# Altium schematic sheet MainBoard_V100_PSU.SchDoc
size A4; SheetNumber: 3; SheetTotal: 22; Title_: PSU
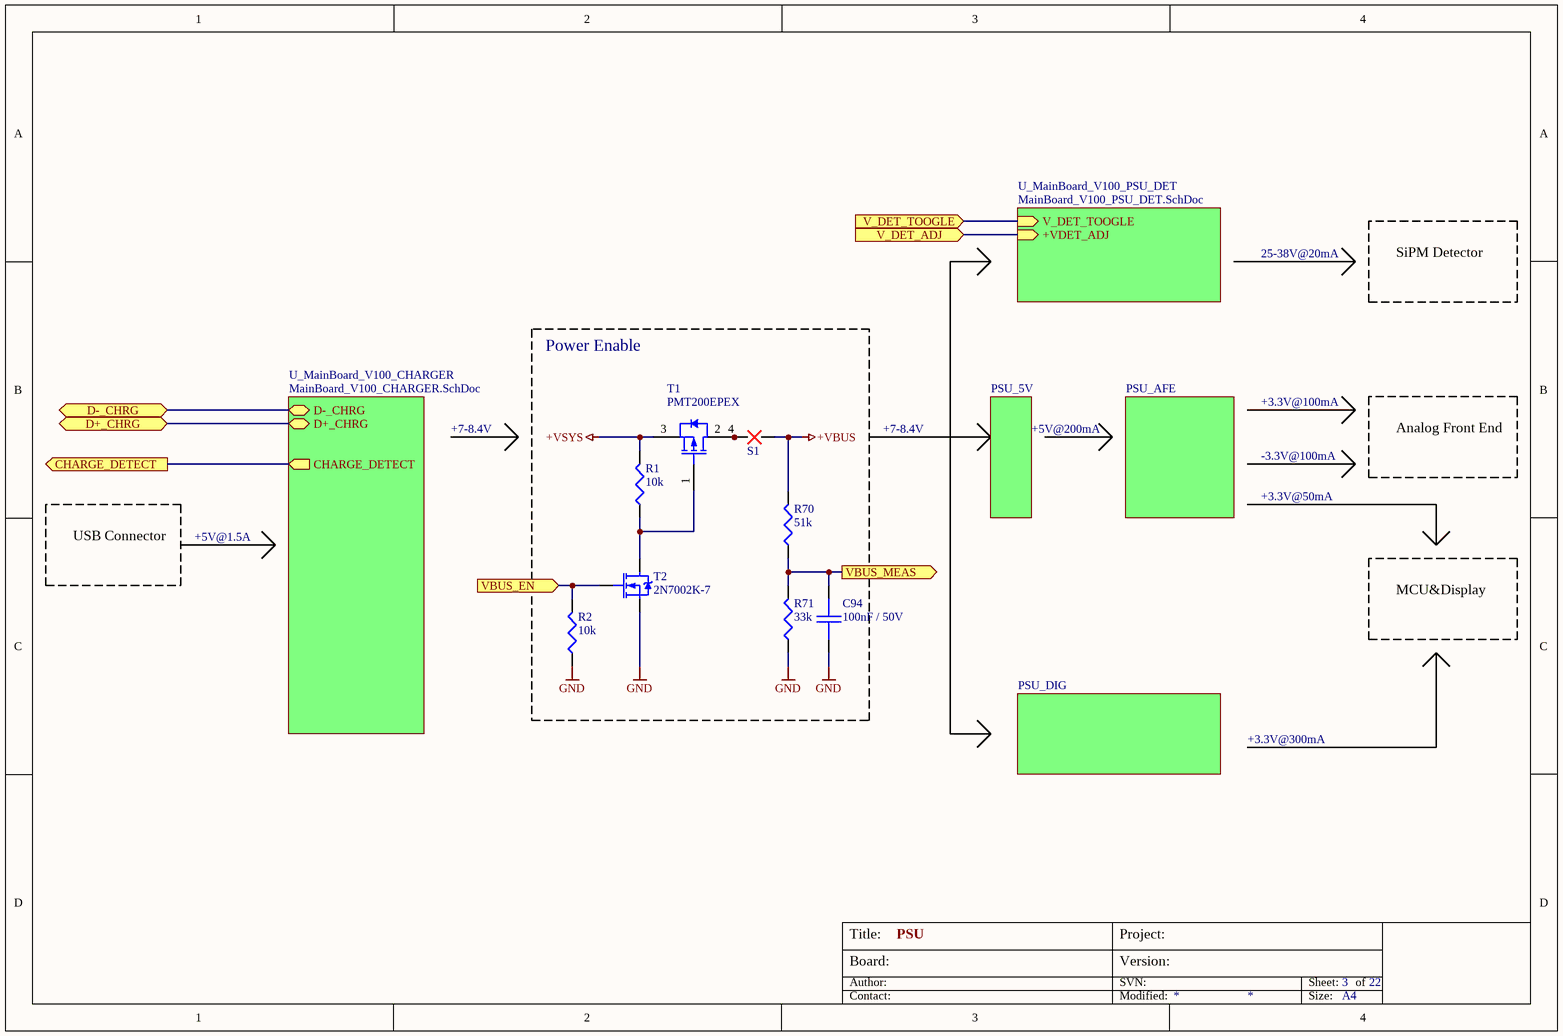
[diagram p0: MainBoard_V100_PSU.SchDoc]

## Parts
C94  100nF / 50V  [0805_C]
R1  10k  [0805]
R2  10k  [0805]
R70  51k  [0805]
R71  33k  [0805]
S1  SPLITER  [SPLITER2_30mil_9mil]  (value not drawn)  (no BOM)
T1  PMT200EPEX  [SOT-223]
T2  2N7002K-7  [SOT-23]

## Blocks framed on the sheet
Power Enable: C94 R1 R2 R70 R71 S1 T1 T2

## Sub-sheets
PSU_5V = MainBoard_V100_PSU_5V.SchDoc: no entries
PSU_AFE = MainBoard_V100_PSU_AFE.SchDoc: no entries
PSU_DIG = MainBoard_V100_PSU_DIG.SchDoc: no entries
U_MainBoard_V100_CHARGER = MainBoard_V100_CHARGER.SchDoc: D-_CHRG (bidir), D+_CHRG (bidir), CHARGE_DETECT (out)
U_MainBoard_V100_PSU_DET = MainBoard_V100_PSU_DET.SchDoc: V_DET_TOOGLE (in), +VDET_ADJ (in)

## Ports
CHARGE_DETECT (out), D+_CHRG (bidir), D-_CHRG (bidir), V_DET_ADJ (in), V_DET_TOOGLE (in), VBUS_EN (in), VBUS_MEAS (out)

## Nets
+VBUS: R70.2 S1.2
+VSYS: R1.2 T1.3(SOURCE)
GND: C94.2 R2.1 R71.1 T2.2(S)
CHARGE_DETECT: port CHARGE_DETECT, sheet U_MainBoard_V100_CHARGER/CHARGE_DETECT
D+_CHRG: port D+_CHRG, sheet U_MainBoard_V100_CHARGER/D+_CHRG
D-_CHRG: port D-_CHRG, sheet U_MainBoard_V100_CHARGER/D-_CHRG
V_DET_ADJ: port V_DET_ADJ, sheet U_MainBoard_V100_PSU_DET/+VDET_ADJ
V_DET_TOOGLE: port V_DET_TOOGLE, sheet U_MainBoard_V100_PSU_DET/V_DET_TOOGLE
VBUS_EN: R2.2 T2.1(G) ; port VBUS_EN
VBUS_MEAS: C94.1 R70.1 R71.2 ; port VBUS_MEAS
NetR1_1: R1.1 T1.1(GATE) T2.3(D)
NetS1_1: S1.1 T1.2(DRAIN) T1.4(DRAIN)

## Notes on the sheet
- 25-38V@20mA
- SiPM Detector
- +7-8.4V
- +5V@200mA
- +3.3V@100mA
- Analog Front End
- -3.3V@100mA
- +3.3V@50mA
- USB Connector
- +5V@1.5A
- MCU&Display
- +3.3V@300mA
- Board:
- Author:
- Title:
- Project:
- SVN:
- Version:
- Sheet:
- of
- Contact:
- Modified:
- Size:
- A4

## Library data of the parts
C94 = 149: 100nF 50V X7R; Part Number: SMD0805-100nF-50V; Azonosító: 149; Category: Passives; Subcategory: PASS_Capacitor; Supplier 1: HESTORE; Supplier 1 order number: 100.011.22
R1 R2 = 59: 10k 0805 0.125W 1%; Part Number: SMD0805-10k 1%; Azonosító: 59; Category: Passives; Subcategory: PASS_Resistor; Supplier 1: HESTORE; Supplier 1 order number: 100.403.38
R70 = 64: 51k 0805 0.125W 5%; Part Number: SMD0805-51k 5%; Azonosító: 64; Category: Passives; Subcategory: PASS_Resistor; Supplier 1: HESTORE; Supplier 1 order number: 100.201.72
R71 = 62: 33k 0805 0.125W 5%; Part Number: SMD0805-33k 5%; Azonosító: 62; Category: Passives; Subcategory: PASS_Resistor; Supplier 1: HESTORE; Supplier 1 order number: 100.449.27
S1 = 272: SPLITER2_30mil_9mil; Azonosító: 272; Part Number: SPLITER2_30mil_9mil; Category: Accessories; Subcategory: ACCE_Other
T1 = 318: PMT200EPEX Power MOSFET, P Channel, 70 V, 2.4 A, 0.167 ohm, SOT-223, Surface Mount; Azonosító: 318; Part Number: PMT200EPEX; Category: Semiconductors; Subcategory: SEMI_FET; Supplier 1: MOUSER; Supplier 1 order number: 771-PMT200EPEX; Supplier 2: FARNELL; Supplier 2 order number: 3940765; Help URL: https://hu.mouser.com/datasheet/2/916/PMT200EPE-1319079.pdf
T2 = 315: 2N7002K-7 Power MOSFET, N Channel, 60 V, 300 mA, 2 ohm, SOT-23, Surface Mount; Azonosító: 315; Part Number: 2N7002K-7; Category: Semiconductors; Subcategory: SEMI_FET; Supplier 1: HESTORE; Supplier 1 order number: 100.411.92; Supplier 2: MOUSER; Supplier 2 order number: 621-2N7002K-7; Help URL: https://hu.mouser.com/datasheet/2/115/DIOD_S_A0012992590_1-2543827.pdf